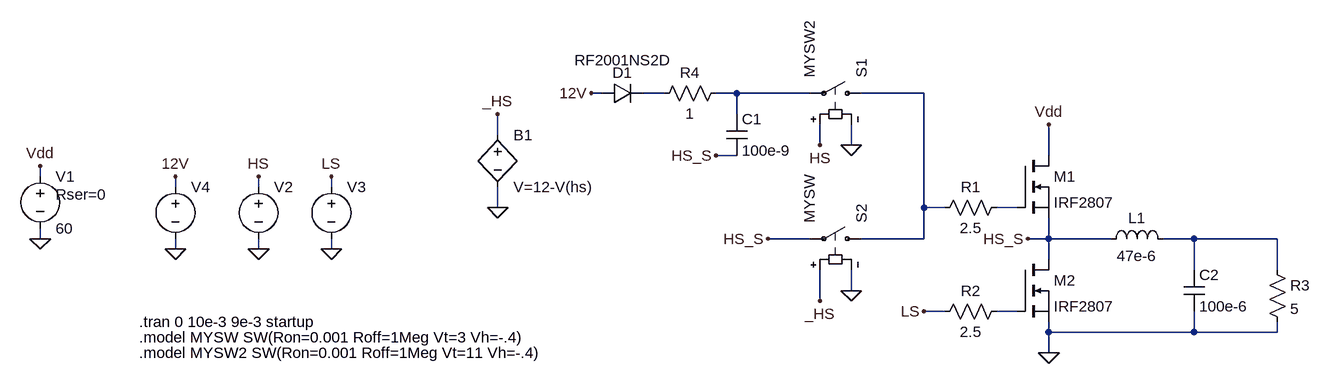
[diagram p0: schematic gate-driver.asc]
gate-driver.asc, the LTspice schematic file:
Version 4
SHEET 1 1408 680
WIRE 0 -368 -16 -368
WIRE 96 -368 64 -368
WIRE 208 -368 176 -368
WIRE 320 -368 208 -368
WIRE 496 -368 400 -368
WIRE 208 -336 208 -368
WIRE -160 -304 -160 -336
WIRE 336 -288 336 -320
WIRE 384 -288 384 -320
WIRE 208 -272 176 -272
WIRE 688 -272 688 -320
WIRE -864 -240 -864 -256
WIRE -656 -224 -656 -240
WIRE -528 -224 -528 -240
WIRE -416 -224 -416 -240
WIRE -160 -192 -160 -224
WIRE 496 -192 496 -368
WIRE 528 -192 496 -192
WIRE 640 -192 608 -192
WIRE -864 -144 -864 -160
WIRE 320 -144 256 -144
WIRE 496 -144 496 -192
WIRE 496 -144 400 -144
WIRE 688 -144 688 -176
WIRE 688 -144 656 -144
WIRE 784 -144 688 -144
WIRE 912 -144 864 -144
WIRE 1040 -144 912 -144
WIRE -656 -128 -656 -144
WIRE -528 -128 -528 -144
WIRE -416 -128 -416 -144
WIRE 688 -112 688 -144
WIRE 912 -96 912 -144
WIRE 1040 -96 1040 -144
WIRE 384 -64 384 -96
WIRE 336 -48 336 -96
WIRE 528 -32 496 -32
WIRE 640 -32 608 -32
WIRE 688 0 688 -16
WIRE 912 0 912 -32
WIRE 912 0 688 0
WIRE 1040 0 1040 -16
WIRE 1040 0 912 0
WIRE 688 32 688 0
FLAG 688 32 0
FLAG -864 -256 Vdd
FLAG -864 -144 0
FLAG 688 -320 Vdd
FLAG -528 -128 0
FLAG 496 -32 LS
FLAG 656 -144 HS_S
FLAG -416 -128 0
FLAG 176 -272 HS_S
FLAG 384 -288 0
FLAG 336 -288 HS
FLAG -416 -240 LS
FLAG -528 -240 HS
FLAG 384 -64 0
FLAG -160 -192 0
FLAG -160 -336 _HS
FLAG 336 -48 _HS
FLAG -656 -128 0
FLAG -656 -240 12V
FLAG -16 -368 12V
FLAG 256 -144 HS_S
SYMBOL res 624 -208 R90
WINDOW 0 0 56 VBottom 2
WINDOW 3 32 56 VTop 2
SYMATTR InstName R1
SYMATTR Value 2.5
SYMBOL res 624 -48 R90
WINDOW 0 0 56 VBottom 2
WINDOW 3 32 56 VTop 2
SYMATTR InstName R2
SYMATTR Value 2.5
SYMBOL nmos 640 -272 R0
SYMATTR InstName M1
SYMATTR Value IRF2807
SYMBOL voltage -864 -256 R0
WINDOW 123 0 0 Left 0
WINDOW 39 24 44 Left 2
SYMATTR SpiceLine Rser=0
SYMATTR InstName V1
SYMATTR Value 60
SYMBOL res 1024 -112 R0
SYMATTR InstName R3
SYMATTR Value 5
SYMBOL ind 768 -128 R270
WINDOW 0 32 56 VTop 2
WINDOW 3 5 56 VBottom 2
SYMATTR InstName L1
SYMATTR Value 47e-6
SYMBOL cap 896 -96 R0
SYMATTR InstName C2
SYMATTR Value 100e-6
SYMBOL voltage -528 -240 R0
WINDOW 3 24 96 Invisible 2
WINDOW 123 0 0 Left 0
SYMATTR Value PULSE(12 0 0 1e-9 1e-9 5e-6 10e-6)
SYMATTR SpiceLine Rser=1e-3
SYMATTR InstName V2
SYMBOL voltage -416 -240 R0
WINDOW 3 24 96 Invisible 2
WINDOW 123 0 0 Left 0
SYMATTR Value PULSE(0 12 0.1e-6 0.1e-9 0.1e-9 4.8e-6 10e-6)
SYMATTR SpiceLine Rser=1e-3
SYMATTR InstName V3
SYMBOL nmos 640 -112 R0
SYMATTR InstName M2
SYMATTR Value IRF2807
SYMBOL cap 192 -336 R0
SYMATTR InstName C1
SYMATTR Value 100e-9
SYMBOL diode 0 -352 R270
WINDOW 0 32 32 VTop 2
WINDOW 3 83 33 VBottom 2
SYMATTR InstName D1
SYMATTR Value RF2001NS2D
SYMBOL sw 416 -368 M270
SYMATTR InstName S1
SYMATTR Value MYSW2
SYMBOL sw 416 -144 M270
SYMATTR InstName S2
SYMATTR Value MYSW
SYMBOL bv -160 -320 R0
SYMATTR InstName B1
SYMATTR Value V=12-V(hs)
SYMBOL voltage -656 -240 R0
WINDOW 3 24 96 Invisible 2
WINDOW 123 0 0 Left 0
SYMATTR Value 12
SYMATTR SpiceLine Rser=1e-3
SYMATTR InstName V4
SYMBOL res 192 -384 R90
WINDOW 0 0 56 VBottom 2
WINDOW 3 32 56 VTop 2
SYMATTR InstName R4
SYMATTR Value 1
TEXT -712 -16 Left 2 !.tran 0 10e-3 9e-3 startup
TEXT -712 8 Left 2 !.model MYSW SW(Ron=0.001 Roff=1Meg Vt=3 Vh=-.4)
TEXT -712 32 Left 2 !.model MYSW2 SW(Ron=0.001 Roff=1Meg Vt=11 Vh=-.4)

The netlist it stands for:
* gate-driver.asc
R1 N004 N003 2.5
R2 N006 LS 2.5
M1 Vdd N004 HS_S HS_S IRF2807
V1 Vdd 0 60 Rser=0
R3 N005 0 5
L1 HS_S N005 47e-6
C2 N005 0 100e-6
V2 HS 0 PULSE(12 0 0 1e-9 1e-9 5e-6 10e-6) Rser=1e-3
V3 LS 0 PULSE(0 12 0.1e-6 0.1e-9 0.1e-9 4.8e-6 10e-6) Rser=1e-3
M2 HS_S N006 0 0 IRF2807
C1 N002 HS_S 100e-9
D1 12V N001 RF2001NS2D
S1 N003 N002 HS 0 MYSW2
S2 N003 HS_S _HS 0 MYSW
B1 _HS 0 V=12-V(hs)
V4 12V 0 12 Rser=1e-3
R4 N002 N001 1
.model D D
.lib standard.dio
.model NMOS NMOS
.model PMOS PMOS
.lib standard.mos
.tran 0 10e-3 9e-3 startup
.model MYSW SW(Ron=0.001 Roff=1Meg Vt=3 Vh=-.4)
.model MYSW2 SW(Ron=0.001 Roff=1Meg Vt=11 Vh=-.4)
.backanno
.end